# EAGLE design fan_light_module (EAGLE 6.1)
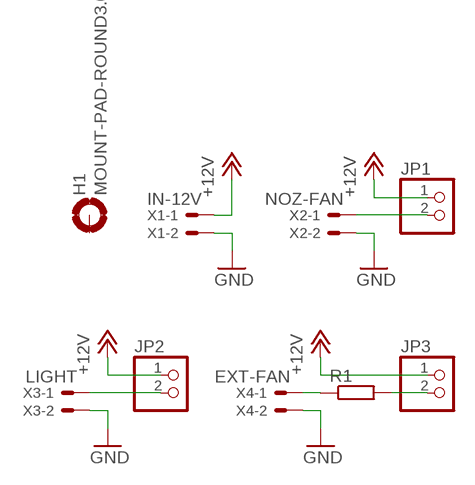
[diagram p0: schematic, sheet 1]

## Parts
H1  MOUNT-PAD-ROUND3.0  [3,0-PAD]
JP1  PINHD-1X2  [1X02]
JP2  PINHD-1X2  [1X02]
JP3  PINHD-1X2  [1X02]
R1  R-EU_0204/7  [0204/7]
X1  IN-12V  JST-XH-02-PIN-LONG-PAD  [JST-XH-02-PACKAGE-LONG-PAD]
X2  NOZ-FAN  JST-XH-02-PIN-LONG-PAD  [JST-XH-02-PACKAGE-LONG-PAD]
X3  LIGHT  JST-XH-02-PIN-LONG-PAD  [JST-XH-02-PACKAGE-LONG-PAD]
X4  EXT-FAN  JST-XH-02-PIN-LONG-PAD  [JST-XH-02-PACKAGE-LONG-PAD]

## Nets
+12V: JP1.1 JP2.1 JP3.1 X1.1
GND: X1.2 X2.2 X3.2 X4.2
N$1: JP1.2 X2.1
N$2: JP2.2 X3.1
N$3: R1.1 X4.1
N$4: JP3.2 R1.2
Unconnected: H1.B3,0(MOUNT)

## Library data of the parts
H1 = holes:MOUNT-PAD-ROUND: MOUNTING PAD, round
JP1-JP3 = pinhead:PINHD-1X2: PIN HEADER
R1 = rcl:R-EU_: RESISTOR, European symbol
X1-X4 = Rembrandt Electronics - JST XH Connectors v1-0:JST-XH-02-PIN: JST XH Connector 2 Pin Wire to board connector. Pitch: 2,54 mm, (0.100") Number of pins: 2 Created by Rembrandt Electronics www.rembrandtelectronics.com

## Board
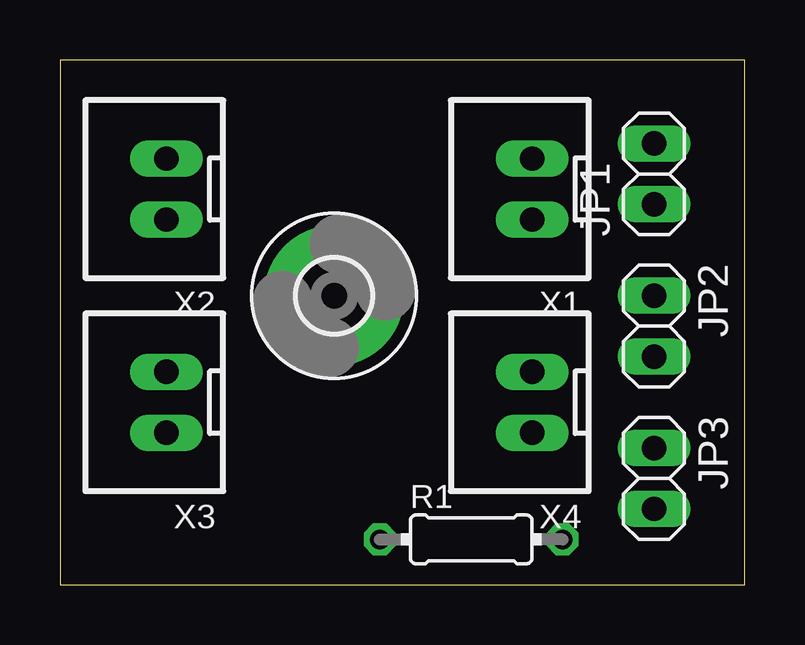
[diagram p1: board, top side]
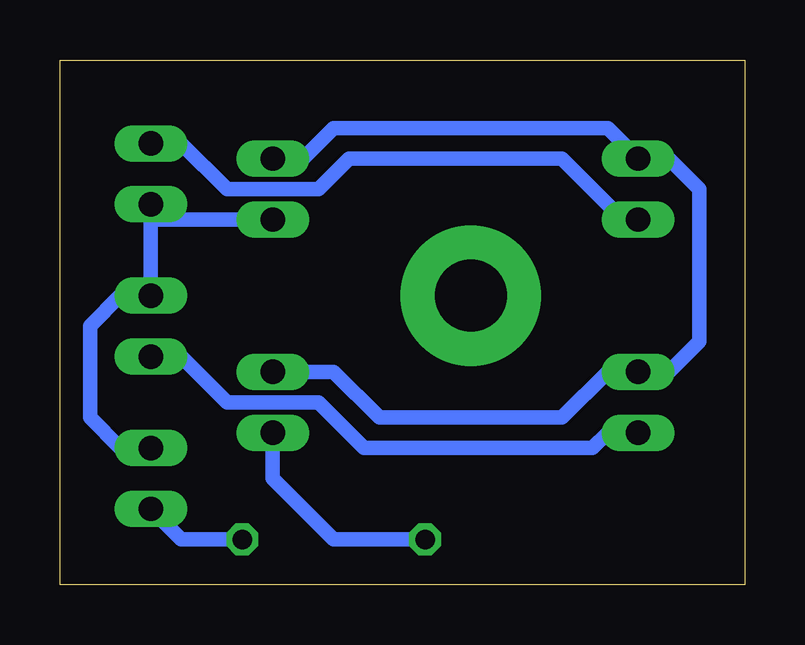
[diagram p2: board, bottom side, seen from below]

Size 28.55 x 21.89 mm. Coordinates in mm from the lower left corner, seen from the top.
Outline: 0,0 28.55,0 28.55,21.89 0,21.89 0,0
Copper layers (1*16): Top 0.035mm / dielectric 1.5mm / Bottom 0.035mm
Design rules: minimum track width 10mil, minimum drill 24mil, track to track 12mil, track to pad 12mil, pad to pad 12mil, via to via 12mil, smd to smd 10mil, copper to edge 12mil, drill to drill 12mil, minimum pad ring 10mil, minimum via ring 10mil, stop-mask expansion 4mil, vias tented up to drill 0mil, thermal gap 12mil

### Footprints (pad centres in the part's own frame; a part is rotated, then mirrored left to right if it is on the bottom)
3,0-PAD = drill 3 pad 5.842: B3,0 0,0
1X02 = drill 1.016 long: 1 -1.27,0; 2 1.27,0
0204/7 = drill 0.813 octagon: 1 -3.81,0; 2 3.81,0
JST-XH-02-PACKAGE-LONG-PAD = drill 1.016 long: 1 -1.27,0; 2 1.27,0

### Placement (x,y rotation side)
H1  11.43,12.06 0 top
JP1  24.77,17.14 90 top
JP2  24.77,10.79 270 top
JP3  24.77,4.45 270 top
R1  17.14,1.91 0 top
X1  19.68,16.51 90 top
X2  4.45,16.51 90 top
X3  4.45,7.62 90 top
X4  19.68,7.62 90 top

### Tracks (layer width: path | path; a pad name or v marks a point on that pad's centre or on a via)
+12V
  Bottom 0.61: JP1.1 24.77,15.24 | 24.77,15.24 JP2.1 26.04,12.06 27.3,10.79 27.3,6.99 26.04,5.71 JP3.1 | X1.1 24.77,15.24
GND
  Bottom 0.61: X4.2 17.14,8.89 15.24,6.99 7.62,6.99 5.71,8.89 X3.2 3.17,8.89 1.91,10.16 1.91,16.51 3.17,17.78 X2.2 5.71,19.05 17.14,19.05 18.41,17.78 X1.2
N$1
  Bottom 0.61: JP1.2 23.5,18.41 21.59,16.51 17.78,16.51 16.51,17.78 7.62,17.78 5.08,15.24 X2.1
N$2
  Bottom 0.61: JP2.2 23.5,9.53 21.59,7.62 17.78,7.62 15.88,5.71 6.35,5.71 5.71,6.35 X3.1
N$3
  Bottom 0.61: R1.1 17.14,1.91 19.68,4.45 X4.1
N$4
  Bottom 0.61: R1.2 23.5,1.91 JP3.2